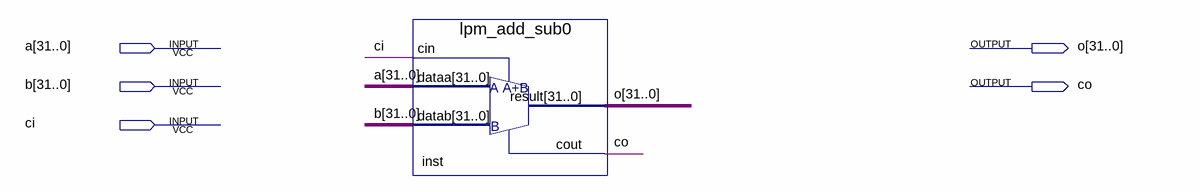
[diagram p0: schematic sheet]
// Quartus schematic ADD32.bdf as structural Verilog: 1 symbols, 5 pins
module ADD32 (
  input  [31:0] a,
  input  [31:0] b,
  input  ci,
  output [31:0] o,
  output co
);

  lpm_add_sub0 inst (.cin(ci), .dataa(a), .datab(b), .result(o), .cout(co));
endmodule
